# Altium schematic sheet 4_HDMI+ETH.SchDoc
size A4; SheetNumber: 4; SheetTotal: 4
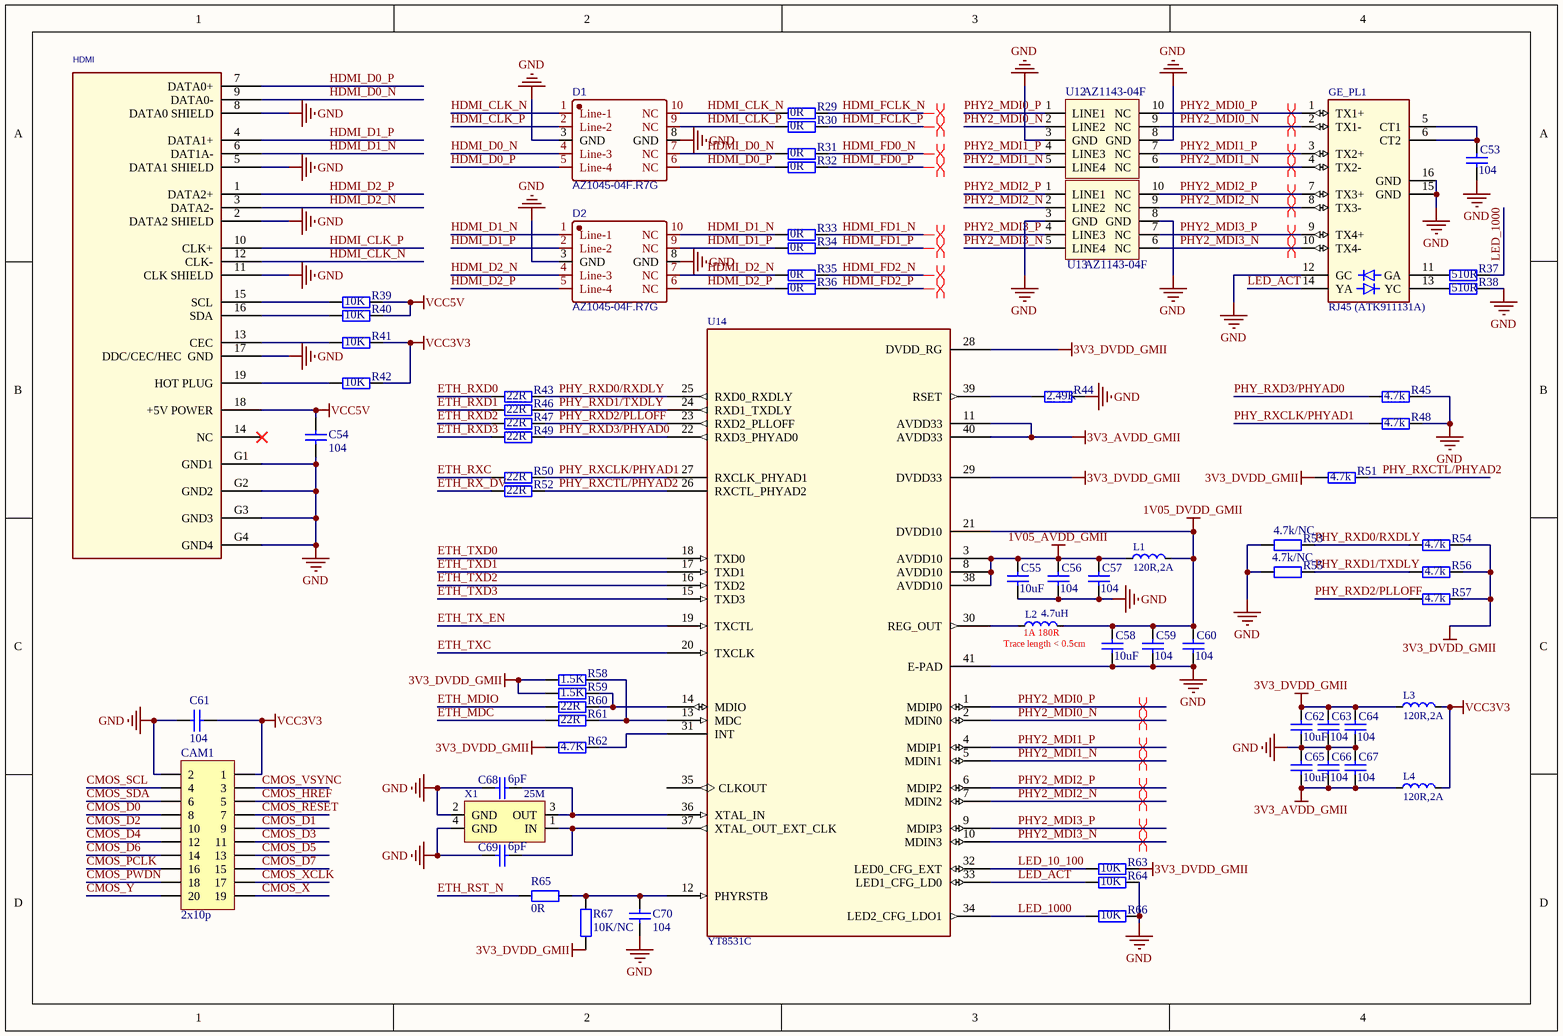
[diagram p0: 4_HDMI+ETH.SchDoc]

## Parts
C53  104  [C 0603]
C54  104  [C 0603]
C55  10uF  [C 0603]
C56  104  [C 0603]
C57  104  [C 0603]
C58  10uF  [C 0603]
C59  104  [C 0603]
C60  104  [C 0603]
C61  104  [C 0603]
C62  10uF  [C 0603]
C63  104  [C 0603]
C64  104  [C 0603]
C65  10uF  [C 0603]
C66  104  [C 0603]
C67  104  [C 0603]
C68  6pF  [C 0603]
C69  6pF  [C 0603]
C70  104  [C 0603]
CAM1  2x10p  [HEAD_2X10P]
D1  AZ1045-04F.R7G  [DFN2510P10E]
D2  AZ1045-04F.R7G  [DFN2510P10E]
GE_PL1  RJ45 (ATK911131A)  [HR911131A]
HDMI  HDMI  [HDMI-A]  (value not drawn)
L1  120R,2A  [L 0603]
L2  4.7uH  [L-2520]
L3  120R,2A  [L 0603]
L4  120R,2A  [L 0603]
R29  0R  [R 0603]
R30  0R  [R 0603]
R31  0R  [R 0603]
R32  0R  [R 0603]
R33  0R  [R 0603]
R34  0R  [R 0603]
R35  0R  [R 0603]
R36  0R  [R 0603]
R37  510R  [R 0603]
R38  510R  [R 0603]
R39  10K  [R 0603]
R40  10K  [R 0603]
R41  10K  [R 0603]
R42  10K  [R 0603]
R43  22R  [R 0603]
R44  2.49K  [R 0603]
R45  4.7k  [R 0603]
R46  22R  [R 0603]
R47  22R  [R 0603]
R48  4.7k  [R 0603]
R49  22R  [R 0603]
R50  22R  [R 0603]
R51  4.7k  [R 0603]
R52  22R  [R 0603]
R53  4.7k/NC  [R 0603]
R54  4.7k  [R 0603]
R55  4.7k/NC  [R 0603]
R56  4.7k  [R 0603]
R57  4.7k  [R 0603]
R58  1.5K  [R 0603]
R59  1.5K  [R 0603]
R60  22R  [R 0603]
R61  22R  [R 0603]
R62  4.7K  [R 0603]
R63  10K  [R 0603]
R64  10K  [R 0603]
R65  0R  [R 0603]
R66  10K  [R 0603]
R67  10K/NC  [R 0603]
U12  AZ1143-04F  [DFN2510P10E]
U13  AZ1143-04F  [DFN2510P10E]
U14  YT8531C  [QFN40 5X5_N]
X1  25M  [XTAL-3225]

## Nets
1V05_AVDD_GMII: C55.1 C56.1 C57.1 L1.1 U14.3(AVDD10) U14.8(AVDD10) U14.38(AVDD10)
1V05_DVDD_GMII: C58.1 C59.1 C60.1 L1.2 L2.2 U14.21(DVDD10)
3V3_AVDD_GMII: C65.2 C66.2 C67.2 L4.1 U14.11(AVDD33) U14.40(AVDD33)
3V3_DVDD_GMII: C62.1 C63.1 C64.1 L3.1 R51.1 R54.2 R56.2 R57.2 R58.1 R59.1 R62.1 R63.2 R67.1 U14.28(DVDD_RG) U14.29(DVDD33)
GND: C53.2 C54.2 C55.2 C56.2 C57.2 C58.2 C59.2 C60.2 C61.2 C62.2 C63.2 C64.2 C65.1 C66.1 C67.1 C68.2 C69.2 C70.2 CAM1.2 D1.3(GND) D1.8(GND) D2.3(GND) D2.8(GND) GE_PL1.12(GC) GE_PL1.15(GND) GE_PL1.16(GND) HDMI.2(DATA2_SHIELD) HDMI.5(DATA1_SHIELD) HDMI.8(DATA0_SHIELD) HDMI.11(CLK_SHIELD) HDMI.17(DDC/CEC/HEC__GND) HDMI.G1(GND1) HDMI.G2(GND2) HDMI.G3(GND3) HDMI.G4(GND4) R38.2 R44.2 R45.2 R48.2 R53.1 R55.1 R64.2 R66.2 U12.3(GND) U12.8(GND) U13.3(GND) U13.8(GND) U14.41(E-PAD) X1.2(GND) X1.4(GND)
VCC3V3: C61.1 CAM1.1 L3.2 L4.2 R41.2 R42.2
VCC5V: C54.1 HDMI.18(+5V_POWER) R39.2 R40.2
CMOS_D0: CAM1.8
CMOS_D1: CAM1.9
CMOS_D2: CAM1.10
CMOS_D3: CAM1.11
CMOS_D4: CAM1.12
CMOS_D5: CAM1.13
CMOS_D6: CAM1.14
CMOS_D7: CAM1.15
CMOS_HREF: CAM1.5
CMOS_PCLK: CAM1.16
CMOS_PWDN: CAM1.18
CMOS_RESET: CAM1.7
CMOS_SCL: CAM1.4
CMOS_SDA: CAM1.6
CMOS_VSYNC: CAM1.3
CMOS_X: CAM1.19
CMOS_XCLK: CAM1.17
CMOS_Y: CAM1.20
ETH_MDC: R61.1
ETH_MDIO: R60.1
ETH_RST_N: R65.2
ETH_RX_DV: R52.1
ETH_RXC: R50.1
ETH_RXD0: R43.1
ETH_RXD1: R46.1
ETH_RXD2: R47.1
ETH_RXD3: R49.1
ETH_TX_EN: U14.19(TXCTL)
ETH_TXC: U14.20(TXCLK)
ETH_TXD0: U14.18(TXD0)
ETH_TXD1: U14.17(TXD1)
ETH_TXD2: U14.16(TXD2)
ETH_TXD3: U14.15(TXD3)
HDMI_CLK_N: D1.1(Line-1) D1.10(NC) HDMI.12(CLK-) R29.1
HDMI_CLK_P: D1.2(Line-2) D1.9(NC) HDMI.10(CLK+) R30.1
HDMI_D0_N: D1.4(Line-3) D1.7(NC) HDMI.9(DATA0-) R31.1
HDMI_D0_P: D1.5(Line-4) D1.6(NC) HDMI.7(DATA0+) R32.1
HDMI_D1_N: D2.1(Line-1) D2.10(NC) HDMI.6(DAT1A-) R33.1
HDMI_D1_P: D2.2(Line-2) D2.9(NC) HDMI.4(DATA1+) R34.1
HDMI_D2_N: D2.4(Line-3) D2.7(NC) HDMI.3(DATA2-) R35.1
HDMI_D2_P: D2.5(Line-4) D2.6(NC) HDMI.1(DATA2+) R36.1
HDMI_FCLK_N: R29.2
HDMI_FCLK_P: R30.2
HDMI_FD0_N: R31.2
HDMI_FD0_P: R32.2
HDMI_FD1_N: R33.2
HDMI_FD1_P: R34.2
HDMI_FD2_N: R35.2
HDMI_FD2_P: R36.2
LED_10_100: R63.1 U14.32(LED0_CFG_EXT)
LED_1000: R37.2 R66.1 U14.34(LED2_CFG_LDO1)
LED_ACT: GE_PL1.14(YA) R64.1 U14.33(LED1_CFG_LD0)
PHY2_MDI0_N: GE_PL1.2(TX1-) U12.2(LINE2) U12.9(NC) U14.2(MDIN0)
PHY2_MDI0_P: GE_PL1.1(TX1+) U12.1(LINE1) U12.10(NC) U14.1(MDIP0)
PHY2_MDI1_N: GE_PL1.4(TX2-) U12.5(LINE4) U12.6(NC) U14.5(MDIN1)
PHY2_MDI1_P: GE_PL1.3(TX2+) U12.4(LINE3) U12.7(NC) U14.4(MDIP1)
PHY2_MDI2_N: GE_PL1.8(TX3-) U13.2(LINE2) U13.9(NC) U14.7(MDIN2)
PHY2_MDI2_P: GE_PL1.7(TX3+) U13.1(LINE1) U13.10(NC) U14.6(MDIP2)
PHY2_MDI3_N: GE_PL1.10(TX4-) U13.5(LINE4) U13.6(NC) U14.10(MDIN3)
PHY2_MDI3_P: GE_PL1.9(TX4+) U13.4(LINE3) U13.7(NC) U14.9(MDIP3)
PHY_RXCLK/PHYAD1: R48.1 R50.2 U14.27(RXCLK_PHYAD1)
PHY_RXCTL/PHYAD2: R51.2 R52.2 U14.26(RXCTL_PHYAD2)
PHY_RXD0/RXDLY: R43.2 R53.2 R54.1 U14.25(RXD0_RXDLY)
PHY_RXD1/TXDLY: R46.2 R55.2 R56.1 U14.24(RXD1_TXDLY)
PHY_RXD2/PLLOFF: R47.2 R57.1 U14.23(RXD2_PLLOFF)
PHY_RXD3/PHYAD0: R45.1 R49.2 U14.22(RXD3_PHYAD0)
NetC53_1: C53.1 GE_PL1.5(CT1) GE_PL1.6(CT2)
NetC68_1: C68.1 U14.36(XTAL_IN) X1.3(OUT)
NetC69_1: C69.1 U14.37(XTAL_OUT_EXT_CLK) X1.1(IN)
NetC70_1: C70.1 R65.1 R67.2 U14.12(PHYRSTB)
NetGE_PL1_11: GE_PL1.11(GA) R37.1
NetGE_PL1_13: GE_PL1.13(YC) R38.1
NetHDMI_13: HDMI.13(CEC) R41.1
NetHDMI_15: HDMI.15(SCL) R39.1
NetHDMI_16: HDMI.16(SDA) R40.1
NetHDMI_19: HDMI.19(HOT_PLUG) R42.1
NetL2_1: L2.1 U14.30(REG_OUT)
NetR44_1: R44.1 U14.39(RSET)
NetR58_2: R58.2 R61.2 U14.13(MDC)
NetR59_2: R59.2 R60.2 U14.14(MDIO)
NetR62_2: R62.2 U14.31(INT)

Not connected (* = marked no-connect by the designer): HDMI 14(NC)*; U14 35(CLKOUT)

## Layout directives
differential pair: HDMI_FCLK_N, HDMI_FCLK_P, HDMI_FD0_N, HDMI_FD0_P, HDMI_FD1_N, HDMI_FD1_P, HDMI_FD2_N, HDMI_FD2_P, PHY2_MDI0_N, PHY2_MDI0_P, PHY2_MDI1_N, PHY2_MDI1_P, PHY2_MDI2_N, PHY2_MDI2_P, PHY2_MDI3_N, PHY2_MDI3_P

## Notes on the sheet
- Trace length < 0.5cm
- (near L2) 1A 180R

## Library data of the parts
C53-C70 = C-0603-SMD
D1 D2 = AZ1045-04F.R7G: BOM_Manufacturer: AMAZING; Contributor: LCSC; BOM_Supplier: LCSC; BOM_Supplier Part: C356811; BOM_Manufacturer Part: AZ1045-04F.R7G; spicePre: D; spiceSymbolName: AZ1045-04F.R7G
GE_PL1 = HR911131A/C: 千兆以太网接口
HDMI = HDMI_A
L1-L4 = L: 小功率贴片电感磁珠
R29-R67 = R: 电阻; BOM名称: 贴片电阻; 版权归属: 正点原子; 学习资源: www.openedv.com; Parameter: 电阻
U12 U13 = AZ1143-04F: ESD保护二极管阵列
U14 = RTL8211F-CG
X1 = XTAL-4P: 4脚无源晶振